# Altium schematic sheet eps_6.0.SchDoc
size A
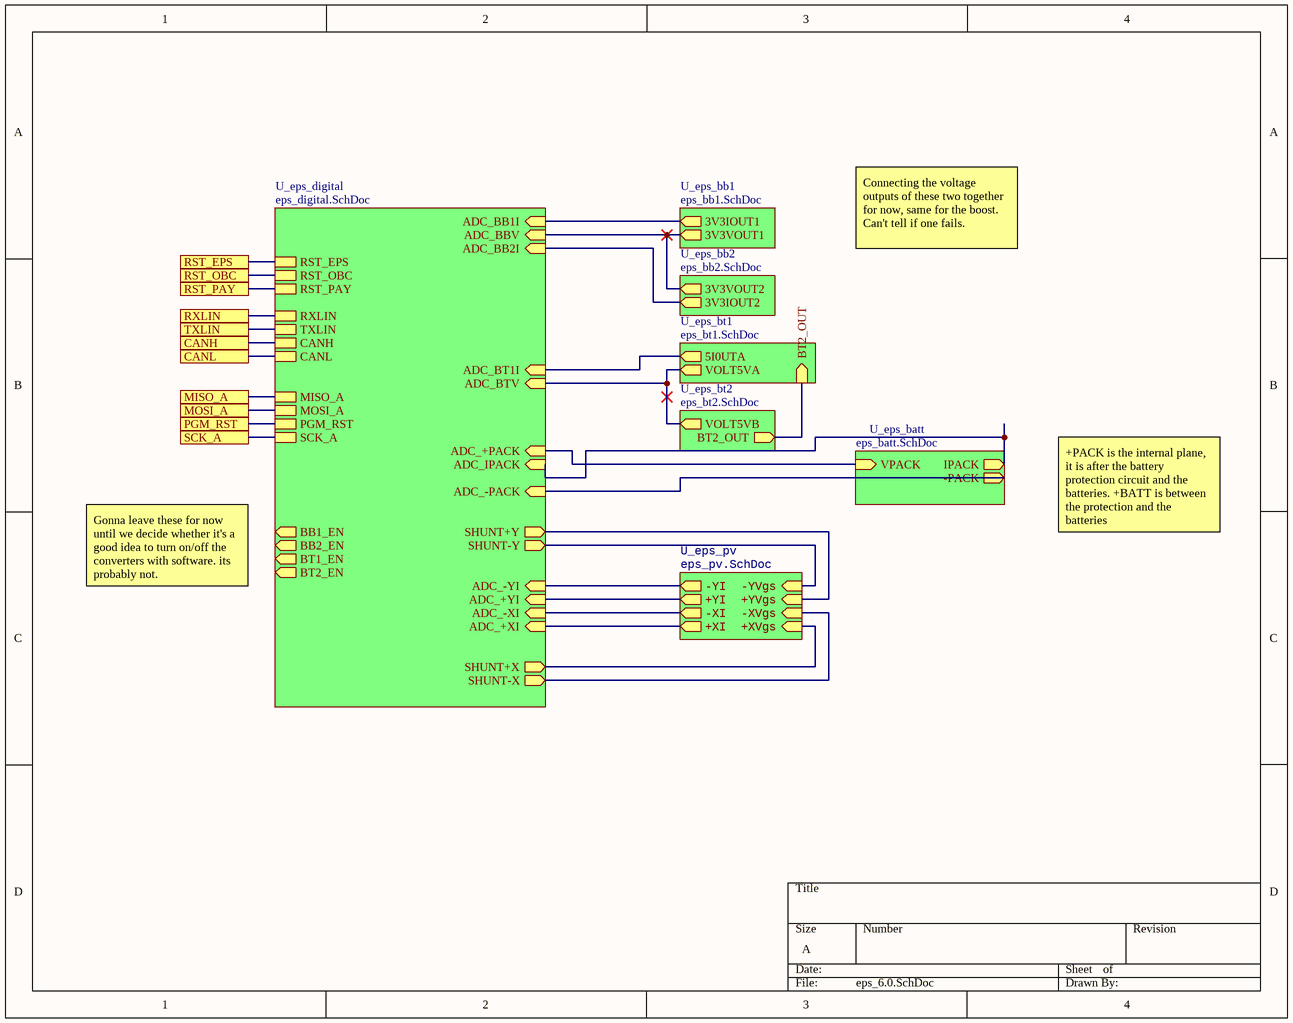
[diagram p0: eps_6.0.SchDoc]

## Sub-sheets
U_eps_batt = eps_batt.SchDoc: IPACK (out), VPACK (in), -PACK (out)
U_eps_bb1 = eps_bb1.SchDoc: 3V3IOUT1 (out), 3V3VOUT1 (out)
U_eps_bb2 = eps_bb2.SchDoc: 3V3IOUT2 (out), 3V3VOUT2 (out)
U_eps_bt1 = eps_bt1.SchDoc: VOLT5VA (out), 5I0UTA (out), BT2_OUT (in)
U_eps_bt2 = eps_bt2.SchDoc: VOLT5VB (out), BT2_OUT (out)
U_eps_digital = eps_digital.SchDoc: RST_EPS, RST_OBC, RST_PAY, RXLIN, TXLIN, CANH, CANL, MISO_A, MOSI_A, PGM_RST, SCK_A, ADC_BTV (in), BT1_EN (out), BT2_EN (out), ADC_BT1I (in), ADC_-PACK (in), ADC_BB1I (in), ADC_BB2I (in), ADC_+XI (in), ADC_-XI (in), ADC_+YI (in), ADC_+PACK (in), ADC_-YI (in), SHUNT-Y (out), SHUNT+Y (out), BB2_EN (out), BB1_EN (out), ADC_BBV (in), SHUNT-X (out), SHUNT+X (out), ADC_IPACK (in)
U_eps_pv = eps_pv.SchDoc: +YI (out), -YI (out), -YVgs (in), +XI (out), +YVgs (in), +XVgs (in), -XVgs (in), -XI (out)

## Ports
CANH, CANL, MISO_A, MOSI_A, PGM_RST, RST_EPS, RST_OBC, RST_PAY, RXLIN, SCK_A, TXLIN

## Nets
CANH: port CANH, sheet U_eps_digital/CANH
CANL: port CANL, sheet U_eps_digital/CANL
MISO_A: port MISO_A, sheet U_eps_digital/MISO_A
MOSI_A: port MOSI_A, sheet U_eps_digital/MOSI_A
PGM_RST: port PGM_RST, sheet U_eps_digital/PGM_RST
RST_EPS: port RST_EPS, sheet U_eps_digital/RST_EPS
RST_OBC: port RST_OBC, sheet U_eps_digital/RST_OBC
RST_PAY: port RST_PAY, sheet U_eps_digital/RST_PAY
RXLIN: port RXLIN, sheet U_eps_digital/RXLIN
SCK_A: port SCK_A, sheet U_eps_digital/SCK_A
TXLIN: port TXLIN, sheet U_eps_digital/TXLIN
(unnamed): sheet U_eps_digital/ADC_BTV, sheet U_eps_bt1/VOLT5VA, sheet U_eps_bt2/VOLT5VB
(unnamed): sheet U_eps_digital/ADC_BT1I, sheet U_eps_bt1/5I0UTA
(unnamed): sheet U_eps_digital/ADC_-PACK, sheet U_eps_batt/-PACK
(unnamed): sheet U_eps_digital/ADC_BB1I, sheet U_eps_bb1/3V3IOUT1
(unnamed): sheet U_eps_digital/ADC_BB2I, sheet U_eps_bb2/3V3IOUT2
(unnamed): sheet U_eps_digital/ADC_+XI, sheet U_eps_pv/+XI
(unnamed): sheet U_eps_digital/ADC_-XI, sheet U_eps_pv/-XI
(unnamed): sheet U_eps_digital/ADC_+YI, sheet U_eps_pv/+YI
(unnamed): sheet U_eps_digital/ADC_+PACK, sheet U_eps_batt/VPACK
(unnamed): sheet U_eps_digital/ADC_-YI, sheet U_eps_pv/-YI
(unnamed): sheet U_eps_digital/SHUNT-Y, sheet U_eps_pv/-YVgs
(unnamed): sheet U_eps_digital/SHUNT+Y, sheet U_eps_pv/+YVgs
(unnamed): sheet U_eps_digital/ADC_BBV, sheet U_eps_bb1/3V3VOUT1, sheet U_eps_bb2/3V3VOUT2
(unnamed): sheet U_eps_digital/SHUNT-X, sheet U_eps_pv/-XVgs
(unnamed): sheet U_eps_digital/SHUNT+X, sheet U_eps_pv/+XVgs
(unnamed): sheet U_eps_digital/ADC_IPACK, sheet U_eps_batt/IPACK
(unnamed): sheet U_eps_bt1/BT2_OUT, sheet U_eps_bt2/BT2_OUT

## Notes on the sheet
- Connecting the voltage outputs of these two together for now, same for the boost. Can't tell if one fails.
- +PACK is the internal plane, it is after the battery protection circuit and the batteries. +BATT is between the protection and the batteries
- Gonna leave these for now until we decide whether it's a good idea to turn on/off the converters with software. its probably not.